# EAGLE design Casa (EAGLE 7.5.0)
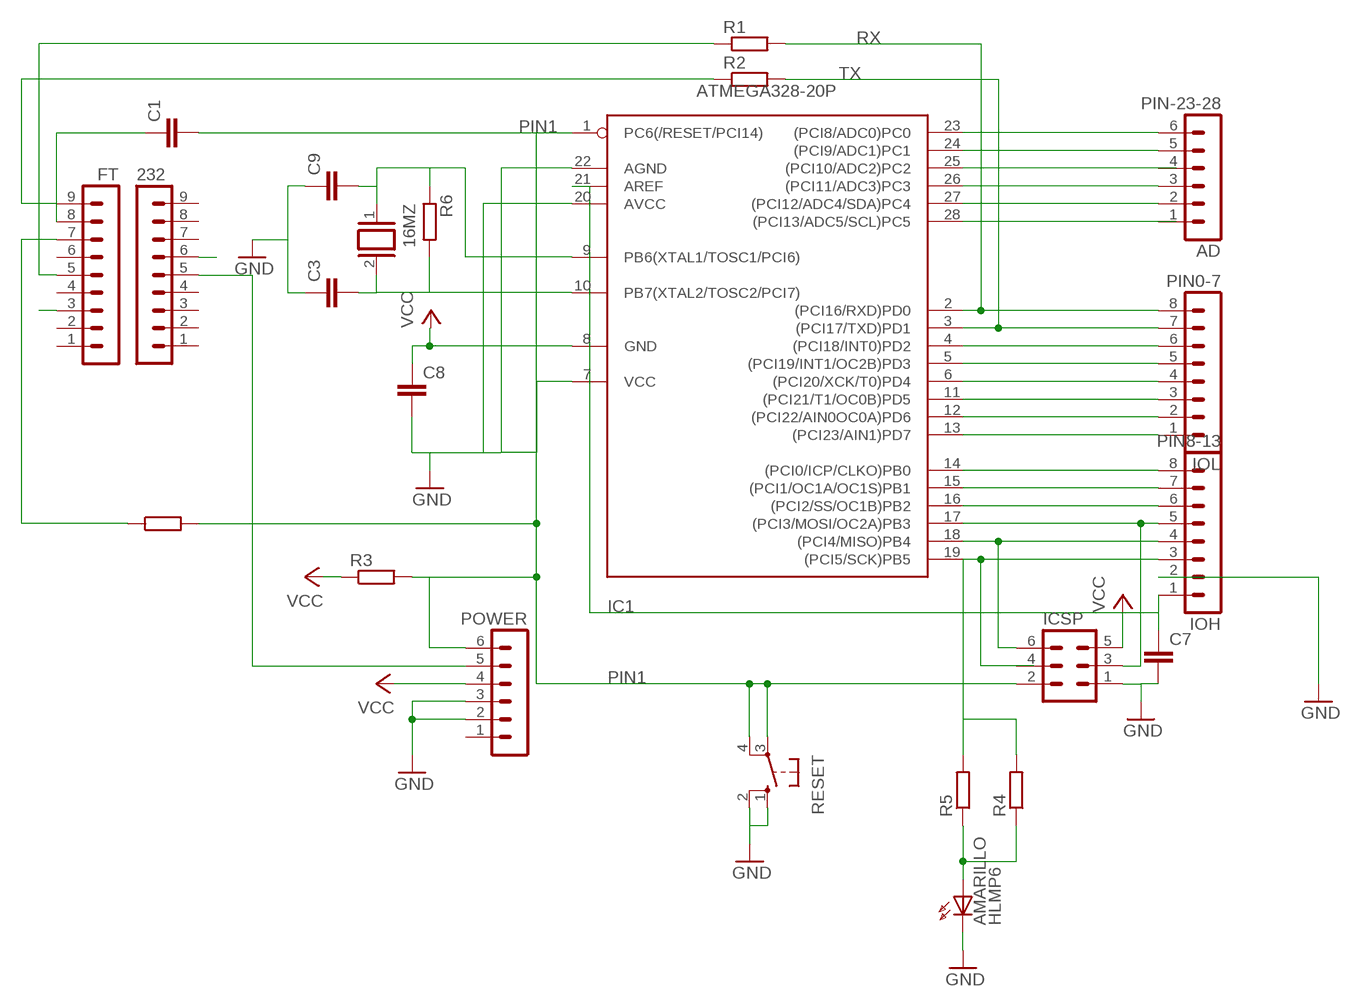
[diagram p0: schematic, sheet 1]

## Parts
16MZ  XTAL/S  [QS]
232  MA09-1  [MA09-1]
AMARILLO  HLMP6  [HLMP6]
C1  C2,5-3  [C2.5-3]
C3  C2,5-3  [C2.5-3]
C7  C2,5-3  [C2.5-3]
C8  C2,5-3  [C2.5-3]
C9  C2,5-3  [C2.5-3]
FT  MA09-1  [MA09-1]
IC1  ATMEGA328-20P  [DIL28-3]
ICSP  MA03-2  [MA03-2]
PIN0-7  IOL  MA08-1  [MA08-1]
PIN8-13  IOH  MA08-1  [MA08-1]
PIN-23-28  AD  MA06-1  [MA06-1]
POWER  MA06-1  [MA06-1]
R1  R-EU_0204/7  [0204/7]
R2  R-EU_0204/7  [0204/7]
R3  R-EU_0204/7  [0204/7]
R4  R-EU_0204/7  [0204/7]
R5  R-EU_0204/7  [0204/7]
R6  R-EU_0204/7  [0204/7]
RESET  10-XX  [B3F-10XX]

## Nets
GND: AMARILLO.K C7.2 C8.2 FT.3 IC1.7(VCC) IC1.20(AVCC) IC1.22(AGND) ICSP.1 PIN8-13.2 POWER.2 POWER.3 RESET.1(S) RESET.2(S1)
N$1: IC1.23((PCI8/ADC0)PC0) PIN-23-28.6
N$2: IC1.24((PCI9/ADC1)PC1) PIN-23-28.5
N$3: IC1.25((PCI10/ADC2)PC2)
N$4: IC1.26((PCI11/ADC3)PC3) PIN-23-28.3
N$5: IC1.27((PCI12/ADC4/SDA)PC4) PIN-23-28.2
N$6: IC1.28((PCI13/ADC5/SCL)PC5)
N$7: C7.1 IC1.21(AREF) PIN8-13.1
N$8: C1.1 FT.8
N$9: IC1.4((PCI18/INT0)PD2) PIN0-7.6
N$10: IC1.5((PCI19/INT1/OC2B)PD3) PIN0-7.5
N$11: IC1.6((PCI20/XCK/T0)PD4) PIN0-7.4
N$12: IC1.11((PCI21/T1/OC0B)PD5) PIN0-7.3
N$13: IC1.12((PCI22/AIN0OC0A)PD6) PIN0-7.2
N$14: IC1.13((PCI23/AIN1)PD7) PIN0-7.1
N$15: IC1.14((PCI0/ICP/CLKO)PB0) PIN8-13.8
N$16: IC1.15((PCI1/OC1A/OC1S)PB1) PIN8-13.7
N$17: IC1.16((PCI2/SS/OC1B)PB2) PIN8-13.6
N$18: IC1.17((PCI3/MOSI/OC2A)PB3) ICSP.3 PIN8-13.5
N$19: IC1.18((PCI4/MISO)PB4) ICSP.6 PIN8-13.4
N$20: IC1.19((PCI5/SCK)PB5) PIN8-13.3 R4.2 R5.2
N$21: 232.5 POWER.5
N$28: AMARILLO.A R4.1 R5.1
N$30: C3.1 C9.1
N$32: FT.7
PIN1: C1.2 IC1.1(PC6(/RESET/PCI14)) ICSP.2 POWER.6 R3.2 RESET.3(P) RESET.4(P1)
PIN8: C8.1 IC1.8(GND)
PIN9: 16MZ.1 C9.2 IC1.9(PB6(XTAL1/TOSC1/PCI6)) R6.1
PIN10: 16MZ.2 C3.2 IC1.10(PB7(XTAL2/TOSC2/PCI7)) R6.2
RX: FT.9 IC1.2((PCI16/RXD)PD0) PIN0-7.8 R1.2 R2.1
TX: FT.5 IC1.3((PCI17/TXD)PD1) PIN0-7.7 R1.1 R2.2
VCC: 232.6 ICSP.5 POWER.4 R3.1
Unconnected: 232.1 232.2 232.3 232.4 232.7 232.8 232.9 FT.1 FT.2 FT.4 FT.6 ICSP.4 PIN-23-28.1 PIN-23-28.4 POWER.1

## Library data of the parts
16MZ = special:XTAL/S: CRYSTAL
232 FT = con-lstb:MA09-1: PIN HEADER; OC_FARNELL: unknown; OC_NEWARK: unknown
AMARILLO = display-hp:HLMP6: LED 2mm horizontal; MF: AGILENT TECHNOLOGIES; MPN: HLMP-6500; OC_FARNELL: 1652490; OC_NEWARK: 40K0088
C1 C3 C7-C9 = capacitor-wima:C: CAPACITOR naming: grid - package width
IC1 = atmega328:ATMEGA328*P: MICROCONTROLLER 32 kBytes FLASH 2 kBytes SRAM 1 kBytes EEPROM USART 8-channel 10 bit ADC
ICSP = con-lstb:MA03-2: PIN HEADER; OC_FARNELL: unknown; OC_NEWARK: unknown
PIN0-7 PIN8-13 = con-lstb:MA08-1: PIN HEADER; OC_FARNELL: unknown; OC_NEWARK: unknown
PIN-23-28 POWER = con-lstb:MA06-1: PIN HEADER; OC_FARNELL: unknown; OC_NEWARK: unknown
R1-R6 = resistor:R-EU_: RESISTOR, European symbol
RESET = switch-omron:10-XX: OMRON SWITCH; MPN: B3F-1000; OC_FARNELL: 176432; OC_NEWARK: 36M3542

## Board
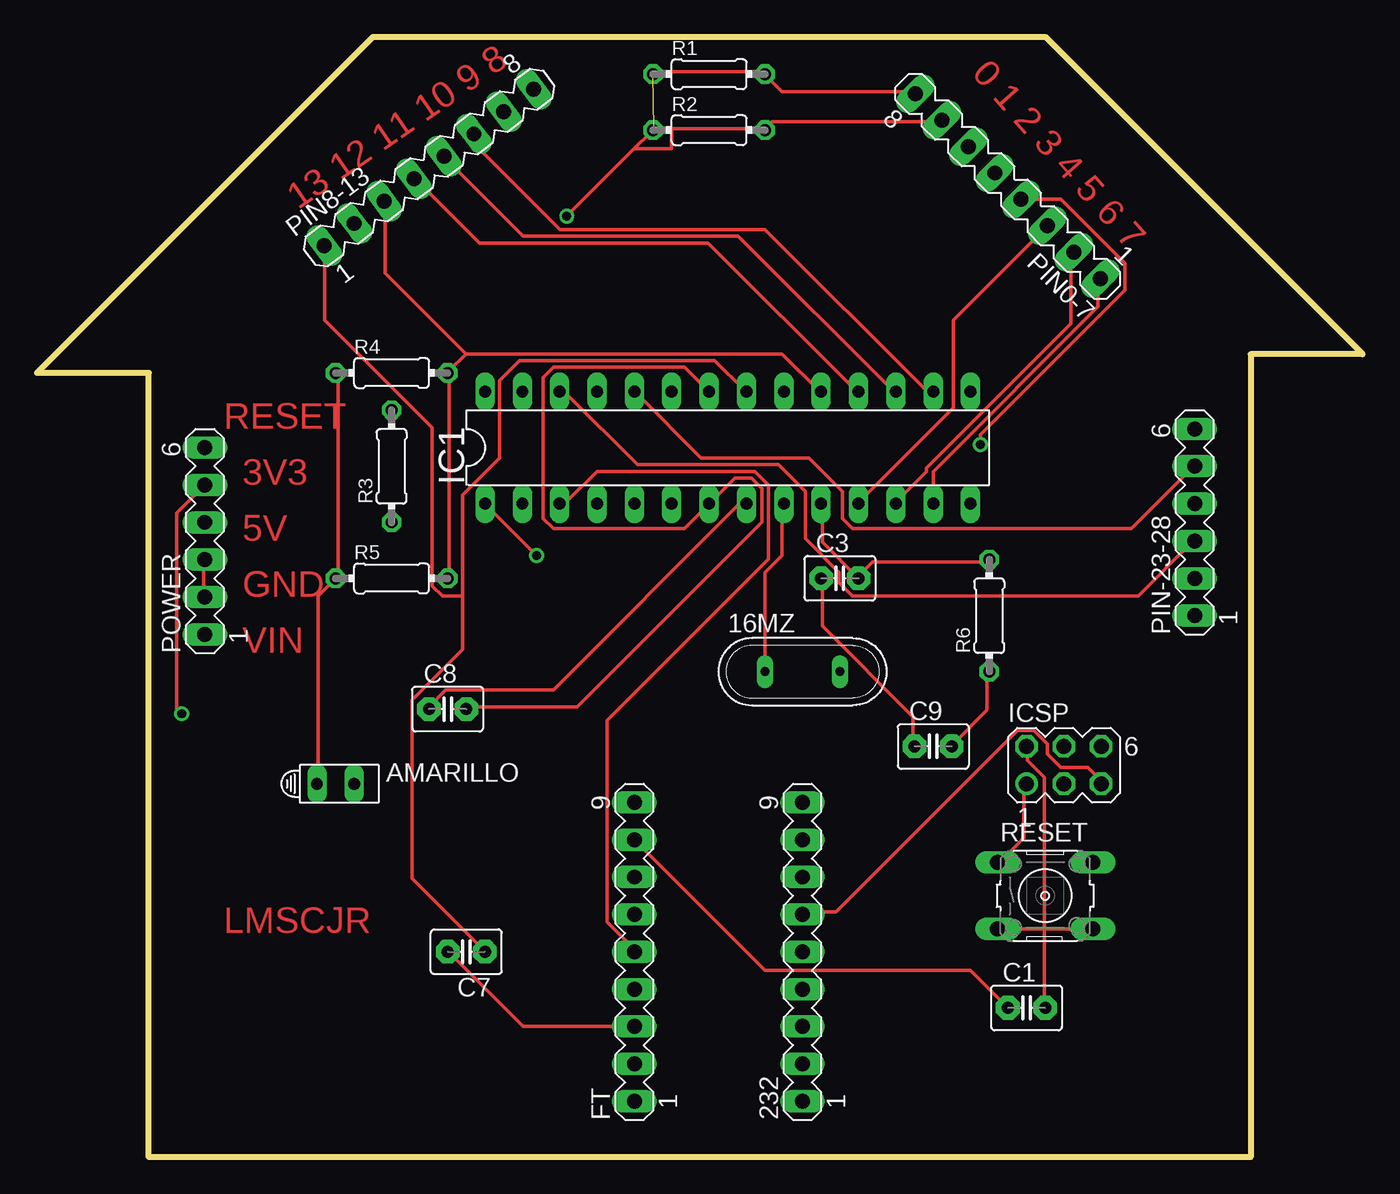
[diagram p1: board, top side]
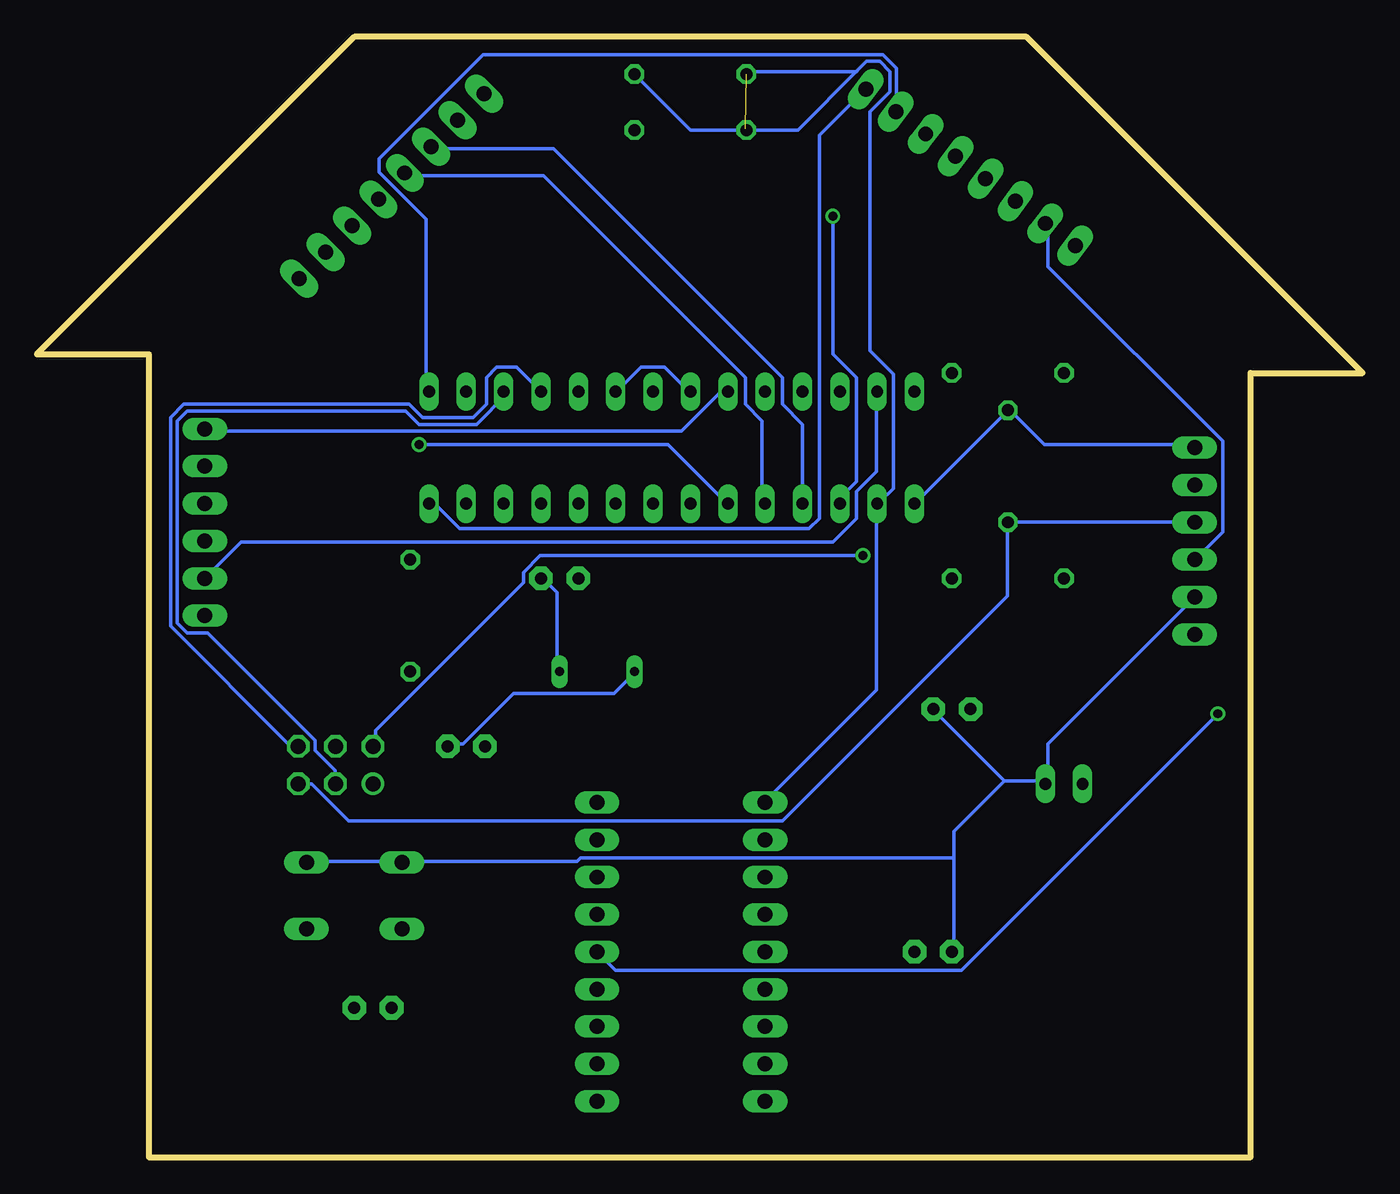
[diagram p2: board, bottom side, seen from below]

Size 90.17 x 76.2 mm. Coordinates in mm from the lower left corner, seen from the top.
Outline: 22.86,76.2 68.58,76.2 90.17,54.61 82.55,54.61 82.55,0 7.62,0 7.62,53.34 0,53.34 22.86,76.2
Copper layers (1*16): Top 0.035mm / dielectric 1.5mm / Bottom 0.035mm
Design rules "default": minimum track width 10mil, minimum drill 24mil, track to track 8mil, track to pad 8mil, pad to pad 8mil, via to via 8mil, smd to smd 8mil, copper to edge 40mil, drill to drill 8mil, minimum pad ring 10mil, minimum via ring 8mil, stop-mask expansion 4mil, vias tented up to drill 0mil, thermal gap 10mil

### Footprints (pad centres in the part's own frame; a part is rotated, then mirrored left to right if it is on the bottom)
QS = drill 0.61 long: 1 -2.54,0; 2 2.54,0
MA09-1 = drill 1.016 long: 1 -10.16,0; 2 -7.62,0; 3 -5.08,0; 4 -2.54,0; 5 0,0; 6 2.54,0; 7 5.08,0; 8 7.62,0; 9 10.16,0
HLMP6 = drill 0.813 long: A -1.27,0; K 1.27,0
C2.5-3 = drill 0.813 pad 1.6 octagon: 1 -1.27,0; 2 1.27,0
DIL28-3 = drill 0.813 long: 1 -16.51,-3.81; 2 -13.97,-3.81; 3 -11.43,-3.81; 4 -8.89,-3.81; 5 -6.35,-3.81; 6 -3.81,-3.81; 7 -1.27,-3.81; 8 1.27,-3.81; 9 3.81,-3.81; 10 6.35,-3.81; 11 8.89,-3.81; 12 11.43,-3.81; 13 13.97,-3.81; 14 16.51,-3.81; 15 16.51,3.81; 16 13.97,3.81; 17 11.43,3.81; 18 8.89,3.81; 19 6.35,3.81; 20 3.81,3.81; 21 1.27,3.81; 22 -1.27,3.81; 23 -3.81,3.81; 24 -6.35,3.81; 25 -8.89,3.81; 26 -11.43,3.81; 27 -13.97,3.81; 28 -16.51,3.81
MA03-2 = drill 1.016: 1 -2.54,-1.27 | drill 1.016 octagon: 2 -2.54,1.27; 3 0,-1.27; 4 0,1.27; 5 2.54,-1.27; 6 2.54,1.27
MA08-1 = drill 1.016 long: 1 -8.89,0; 2 -6.35,0; 3 -3.81,0; 4 -1.27,0; 5 1.27,0; 6 3.81,0; 7 6.35,0; 8 8.89,0
MA06-1 = drill 1.016 long: 1 -6.35,0; 2 -3.81,0; 3 -1.27,0; 4 1.27,0; 5 3.81,0; 6 6.35,0
0204/7 = drill 0.813 octagon: 1 -3.81,0; 2 3.81,0
B3F-10XX = drill 1.016 long: 1 -3.251,2.261; 2 3.251,2.261; 3 -3.251,-2.261; 4 3.251,-2.261

### Placement (x,y rotation side)
16MZ  52.07,33.02 0 top
232  52.07,13.97 90 top
AMARILLO  20.32,25.4 0 top
C1  67.31,10.16 0 top
C3  54.61,39.37 0 top
C7  29.21,13.97 180 top
C8  27.94,30.48 0 top
C9  60.96,27.94 0 top
FT  40.64,13.97 90 top
IC1  46.99,48.26 0 top
ICSP  69.85,26.67 0 top
PIN0-7  66.04,66.04 135 top
PIN8-13  26.67,67.31 36.8 top
PIN-23-28  78.74,43.18 90 top
POWER  11.43,41.91 90 top
R1  45.72,73.66 0 top
R2  45.72,69.85 0 top
R3  24.13,46.99 90 top
R4  24.13,53.34 0 top
R5  24.13,39.37 0 top
R6  64.77,36.83 90 top
RESET  68.58,17.78 0 top

### Tracks (layer width: path | path; a pad name or v marks a point on that pad's centre or on a via)
GND
  Top 0.254: POWER.2 11.35,38.18 11.35,40.46 POWER.3 | ICSP.1 67.13,25.38 67.13,21.72 65.53,20.12 RESET.1 | C8.2 29.41,30.63 36.73,30.63 49.3,43.2 49.3,45.49 48.62,46.18 47.47,46.18 45.87,44.58 IC1.7 45.64,44.35 44.04,42.75 35.13,42.75 34.44,43.43 34.44,53.03 35.13,53.72 44.04,53.72 45.64,52.12 IC1.22 | FT.3 40.62,8.91 33.07,8.91 28.04,13.95 C7.2
  Bottom 0.254: PIN8-13.2 21.41,63.32 21.41,60.58 9.52,48.69 9.52,42.52 11.35,40.69 POWER.3 | RESET.2 71.7,20.12 65.53,20.12 RESET.1 65.3,20.12 53.42,20.12 53.19,20.34 27.81,20.34 | IC1.22 45.87,52.12 47.47,53.72 49.07,53.72 50.67,52.12 IC1.20 | 24.38,25.6 21.64,25.6 AMARILLO.K 21.41,25.6 21.41,28.12 POWER.2 | 24.38,25.6 29.18,30.4 C8.2 | 27.81,20.34 27.81,22.17 24.38,25.6 | 27.81,20.34 27.81,14.17 C7.2
N$1
  Bottom 0.254: IC1.23 43.36,51.89 43.82,51.89 46.33,49.38 78.56,49.38 PIN-23-28.6
N$2
  Top 0.254: IC1.24 40.84,51.89 45.19,47.55 52.5,47.55 54.79,45.26 54.79,43.43 55.47,42.75 74.45,42.75 78.56,46.86 PIN-23-28.5
N$4
  Top 0.254: IC1.26 35.59,51.89 36.04,51.89 40.84,47.09 50.44,47.09 52.27,45.26 52.27,42.06 54.56,39.78 54.56,39.09 55.47,38.18 74.91,38.18 78.56,41.83 PIN-23-28.3
N$5
  Bottom 0.254: PIN-23-28.2 76.28,41.83 36.04,41.83 34.44,43.43 34.44,45.26 33.07,46.63 33.07,51.89 IC1.27
N$7
  Top 0.254: 28.96,38.18 28.96,34.52 25.53,31.09 25.53,18.97 30.33,14.17 C7.1 | 28.96,38.18 28.96,45.03 31.47,47.55 31.47,52.81 32.84,54.18 46.1,54.18 48.16,52.12 IC1.21 | 28.96,38.18 27.58,38.18 26.9,38.86 26.9,49.61 19.58,56.92 19.58,61.95 PIN8-13.1
N$8
  Top 0.254: FT.8 49.53,12.7 63.5,12.7 C1.1
N$9
  Bottom 0.254: IC1.4 38.1,49.84 39.47,51.21 39.47,53.03 55.02,68.58 63.25,68.58 PIN0-7.6
N$10
  Bottom 0.254: IC1.5 40.84,44.58 40.84,50.06 41.99,51.21 41.99,53.03 55.7,66.75 65.07,66.75 PIN0-7.5
N$11  (via drill 0.61)
  Top 0.254: v64.16,48.46 64.16,49.15 73.99,58.98 73.99,60.81 69.65,65.15 67.13,65.15 PIN0-7.4
  Bottom 0.254: v64.16,48.46 47.24,48.46 43.36,44.58 IC1.6
N$12
  Top 0.254: IC1.11 55.93,44.58 62.33,50.98 62.33,56.92 68.73,63.32 PIN0-7.3
N$13
  Top 0.254: IC1.12 58.45,44.58 60.5,46.63 60.5,46.86 70.33,56.69 70.33,61.49 PIN0-7.2
N$14
  Top 0.254: IC1.13 60.96,46.63 72.16,57.84 72.16,59.66 PIN0-7.1
N$15
  Bottom 0.254: IC1.14 63.48,44.35 63.02,44.35 61.42,42.75 37.64,42.75 36.96,43.43 36.96,69.49 33.98,72.47 PIN8-13.8
N$16
  Bottom 0.254: IC1.15 63.7,52.12 63.7,63.78 66.9,66.98 66.9,67.89 59.82,74.98 32.61,74.98 31.7,74.07 31.7,71.32 PIN8-13.7
N$17
  Top 0.254: IC1.16 60.96,52.12 60.5,52.12 49.53,63.09 35.59,63.09 29.87,68.81 29.87,69.49 PIN8-13.6
N$18
  Top 0.254: IC1.17 58.22,52.12 47.7,62.64 33.07,62.64 27.81,67.89 PIN8-13.5
  Bottom 0.254: ICSP.3 69.88,25.6 69.88,26.29 71.25,27.66 71.25,28.35 78.56,35.66 79.93,35.66 80.62,36.35 80.62,50.06 79.93,50.75 65.07,50.75 64.16,49.84 60.27,49.84 58.22,51.89 IC1.17
N$19
  Top 0.254: IC1.18 55.7,52.12 45.64,62.18 30.1,62.18 25.76,66.52 PIN8-13.4
  Bottom 0.254: IC1.18 57.53,53.72 58.9,53.72 59.59,53.03 59.59,51.21 60.5,50.29 63.93,50.29 64.85,51.21 80.16,51.21 81.08,50.29 81.08,36.12 73.08,28.12 72.39,28.12 ICSP.6
N$20
  Top 0.254: R5.2 28.04,39.55 28.04,53.26 R4.2 28.04,53.49 29.18,54.63 | 29.18,54.63 50.67,54.63 53.19,52.12 IC1.19 | 29.18,54.63 23.7,60.12 23.7,64.92 PIN8-13.3
N$21  (via drill 0.61)
  Top 0.254: POWER.5 9.52,43.81 9.52,30.16 v9.84,30.16
  Bottom 0.254: v9.84,30.16 27.3,12.7 50.8,12.7 232.5
N$28
  Top 0.254: AMARILLO.A 19.13,25.6 19.13,38.18 R5.1 20.5,39.55 20.5,53.26 R4.1
N$30
  Top 0.254: C3.1 53.42,39.32 53.42,36.12 59.59,29.95 59.59,28.12 C9.1
PIN1  (via drill 0.61)
  Top 0.254: 68.5,15.54 71.7,15.54 RESET.4 | 68.5,15.54 65.53,15.54 RESET.3 | 68.5,15.54 68.5,25.83 67.36,26.98 67.36,27.89 ICSP.2 | 68.5,15.54 68.5,10.48 | 68.5,10.48 68.5,10.29 | v33.98,40.92 30.56,44.35 IC1.1 | C1.2 68.58,10.48 68.5,10.48
  Bottom 0.254: IC1.1 30.33,44.58 24.15,50.75 R3.2 23.93,50.75 21.64,48.46 11.58,48.46 POWER.6 | v33.98,40.92 55.93,40.92 57.07,39.78 57.07,39.09 67.13,29.03 67.13,28.12 ICSP.2
PIN8
  Top 0.254: IC1.8 48.16,44.35 47.7,44.35 35.13,31.77 27.81,31.77 26.67,30.63 C8.1
PIN9
  Top 0.254: R6.1 64.62,32.92 64.62,30.4 62.33,28.12 C9.2 | 16MZ.1 49.53,39.78 50.67,40.92 50.67,44.35 IC1.9
  Bottom 0.254: C9.2 62.1,28.12 61.19,28.12 57.76,31.55 50.9,31.55 49.53,32.92 16MZ.1
PIN10
  Top 0.254: IC1.10 53.42,44.35 53.42,41.83 C3.2 55.93,39.55 56.85,40.46 64.62,40.46 R6.2
  Bottom 0.254: 16MZ.2 54.79,33.15 54.79,38.41 55.7,39.32 C3.2
RX
  Top 0.254: 41.99,73.84 49.53,73.84 R1.2 49.53,73.61 50.67,72.47 59.59,72.47 PIN0-7.8
  Bottom 0.254: FT.9 40.62,24.23 33.07,31.77 33.07,44.35 IC1.2 32.84,44.58 31.93,45.49 31.93,53.26 33.53,54.86 33.53,71.09 32.16,72.47 32.16,73.84 32.84,74.52 33.76,74.52 34.3,73.98 | 41.76,73.84 34.44,73.84 34.3,73.98 | R1.2 45.72,69.85 R2.1 38.42,69.85 34.29,73.98 34.3,73.98
TX  (via drill 0.61)  (1 unrouted)
  Top 0.254: 49.53,69.95 43.18,69.95 | 43.18,69.95 41.99,69.95 | 49.53,69.95 49.99,70.41 61.42,70.41 PIN0-7.7 | 49.53,69.95 R2.2 | IC1.3 35.59,44.58 36.04,44.58 38.1,46.63 48.84,46.63 49.76,45.72 49.76,40.69 38.79,29.72 38.79,16 40.62,14.17 FT.5 | v36.04,64.01 40.63,68.59 | 40.63,68.59 41.76,69.72 | 43.18,69.95 43.18,68.58 40.64,68.58 40.63,68.59
  Bottom 0.254: v36.04,64.01 36.04,54.63 34.44,53.03 34.44,45.95 35.36,45.03 35.36,44.58 IC1.3
VCC
  Top 0.254: 232.6 52.27,16.69 54.33,16.69 66.67,29.03 67.82,29.03 68.73,28.12 68.73,27.43 69.65,26.52 71.48,26.52 72.39,25.6 ICSP.5
  Bottom 0.254: POWER.4 11.58,43.2 23.93,43.2 R3.1 24.15,42.98 24.15,38.18 39.47,22.86 68.96,22.86 71.48,25.38 72.39,25.38 ICSP.5

### Text on the board
Top: 13 12 11 10 9 8 | 0 1 2 3 4 5 6 7 | RESET | 3V3 | 5V | GND | VIN | LMSCJR